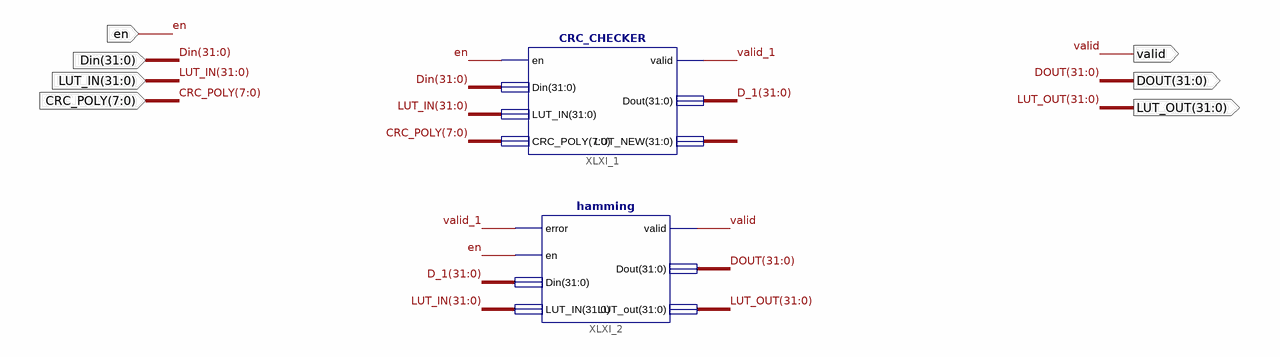
[diagram p0: schematic sheet 1]
// Xilinx ISE schematic EDAC_CRC_HAMMING.sch (spartan6) as structural Verilog: 2 symbols, 7 ports
module EDAC_CRC_HAMMING (
  input  [31:0] Din,
  input  [31:0] LUT_IN,
  input  [7:0] CRC_POLY,
  input  en,
  output [31:0] LUT_OUT,
  output [31:0] DOUT,
  output valid
);

  wire valid_1;
  wire [31:0] D_1, XLXN_17;

  CRC_CHECKER XLXI_1 (
    .en(en), .Din(Din), .LUT_IN(LUT_IN), .CRC_POLY(CRC_POLY), .valid(valid_1), .Dout(D_1), .LUT_NEW(XLXN_17));
  hamming XLXI_2 (.error(valid_1), .en(en), .Din(D_1), .LUT_IN(LUT_IN), .valid(valid), .Dout(DOUT), .LUT_out(LUT_OUT));
endmodule
